# EAGLE design CAN_Shield_Board5 (EAGLE 6.6.0)
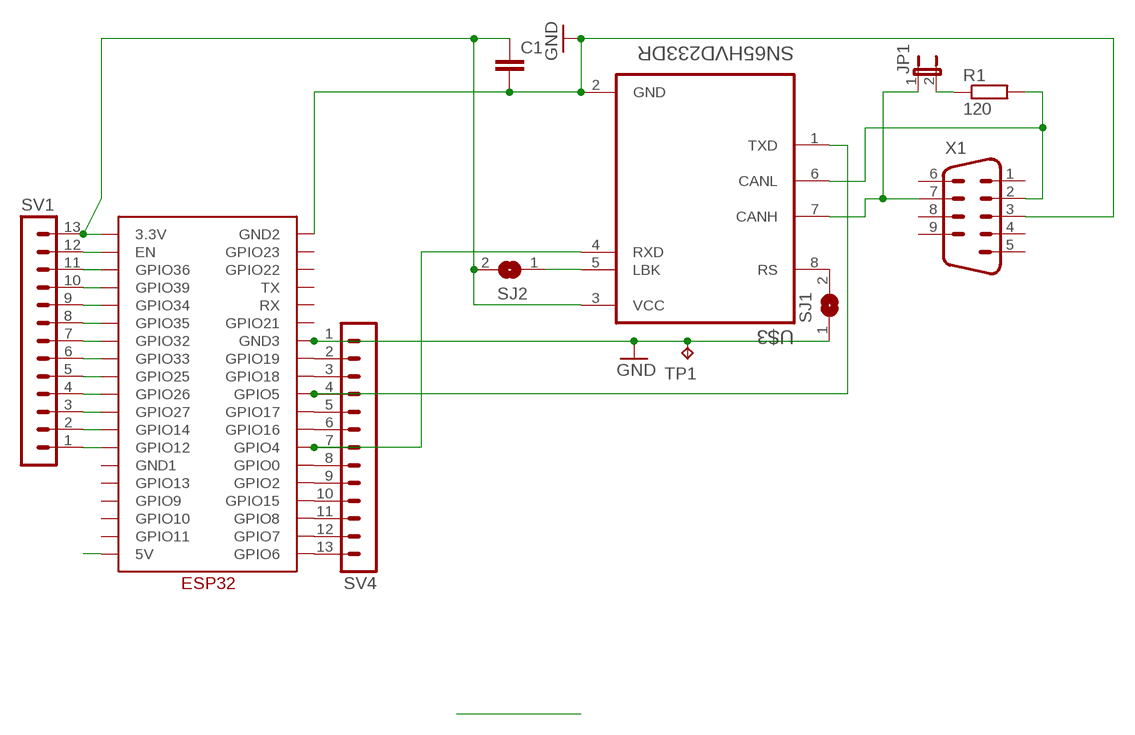
[diagram p0: schematic, sheet 1]

## Parts
C1  C-EUC0805  [C0805]
JP1  JP1E  [JP1]
R1  120  R-EU_R0805  [R0805]
SJ1  SJ  [SJ]
SJ2  SJ  [SJ]
SV1  MA13-1  [MA13-1]
SV4  MA13-1  [MA13-1]
TP1  TPPAD1-13Y  [P1-13Y]
U$1  ESP32  [ESP32]
U$3  SN65HVD233DR  [SOIC127P599X175-8N]
X1  M09HP  [M09HP]

## Nets
CANHI: JP1.1 U$3.7(CANH) X1.7
CANLO: R1.2 U$3.6(CANL) X1.2
CANRX: SV4.7 U$1.GPIO4 U$3.4(RXD)
CANTX: SV4.4 U$1.GPIO5 U$3.1(TXD)
GND: C1.2 SJ1.1 SV4.1 TP1.TP U$1.GND2 U$1.GND3 U$3.2(GND) X1.3
N$1: SV1.1 U$1.GPIO12
N$2: SV1.2 U$1.GPIO14
N$3: SV1.3 U$1.GPIO27
N$4: SV1.4 U$1.GPIO26
N$5: SV1.5 U$1.GPIO25
N$6: SJ1.2 U$3.8(RS)
N$7: SV1.6 U$1.GPIO33
N$8: SV1.7 U$1.GPIO32
N$9: SV1.8 U$1.GPIO35
N$10: SV1.9 U$1.GPIO34
N$11: SV1.10 U$1.GPIO39
N$12: SV1.11 U$1.GPIO36
N$13: SJ2.1 U$3.5(LBK)
N$15: SV1.12 U$1.EN
N$18: SV4.2 U$1.GPIO19
N$19: SV4.3 U$1.GPIO18
N$20: SV4.5 U$1.GPIO17
N$21: SV4.6 U$1.GPIO16
N$22: SV4.8 U$1.GPIO0
N$25: SV4.9 U$1.GPIO2
N$27: SV4.10 U$1.GPIO15
N$31: JP1.2 R1.1
N$33: SV4.11 U$1.GPIO8
N$34: SV4.12 U$1.GPIO7
N$35: U$1.5V
N$36: SV4.13 U$1.GPIO6
VCC: C1.1 SJ2.2 SV1.13 U$1.3.3V U$3.3(VCC)
Unconnected: U$1.GND1 U$1.GPIO9 U$1.GPIO10 U$1.GPIO11 U$1.GPIO13 U$1.GPIO21 U$1.GPIO22 U$1.GPIO23 U$1.RX U$1.TX X1.1 X1.4 X1.5 X1.6 X1.8 X1.9

## Library data of the parts
C1 = rcl:C-EU: CAPACITOR, European symbol
JP1 = jumper:JP1E: JUMPER
R1 = rcl:R-EU_: RESISTOR, European symbol
SJ1 SJ2 = jumper:SJ: SMD solder JUMPER
SV1 SV4 = con-lstb:MA13-1: PIN HEADER; OC_FARNELL: unknown; OC_NEWARK: unknown
TP1 = testpad:TP: Test pad
U$1 = ESP32:ESP32
U$3 = SN65HVD233DR:SN65HVD233DR: Check availability <https://pricing.snapeda.com/parts/SN65HVD233DR/Texas%20Instruments/view-part?ref=eda>; AVAILABILITY: In Stock; DESCRIPTION: 3.3 V CAN Transceiver with Standby Mode, Loopback; MF: Texas Instruments; MP: SN65HVD233DR; PACKAGE: SOIC-8 Texas Instruments; PRICE: None; PURCHASE-URL: https://pricing.snapeda.com/search/part/SN65HVD233DR/?ref=eda
X1 = con-subd:M09: SUB-D; OC_FARNELL: unknown; OC_NEWARK: unknown

## Board
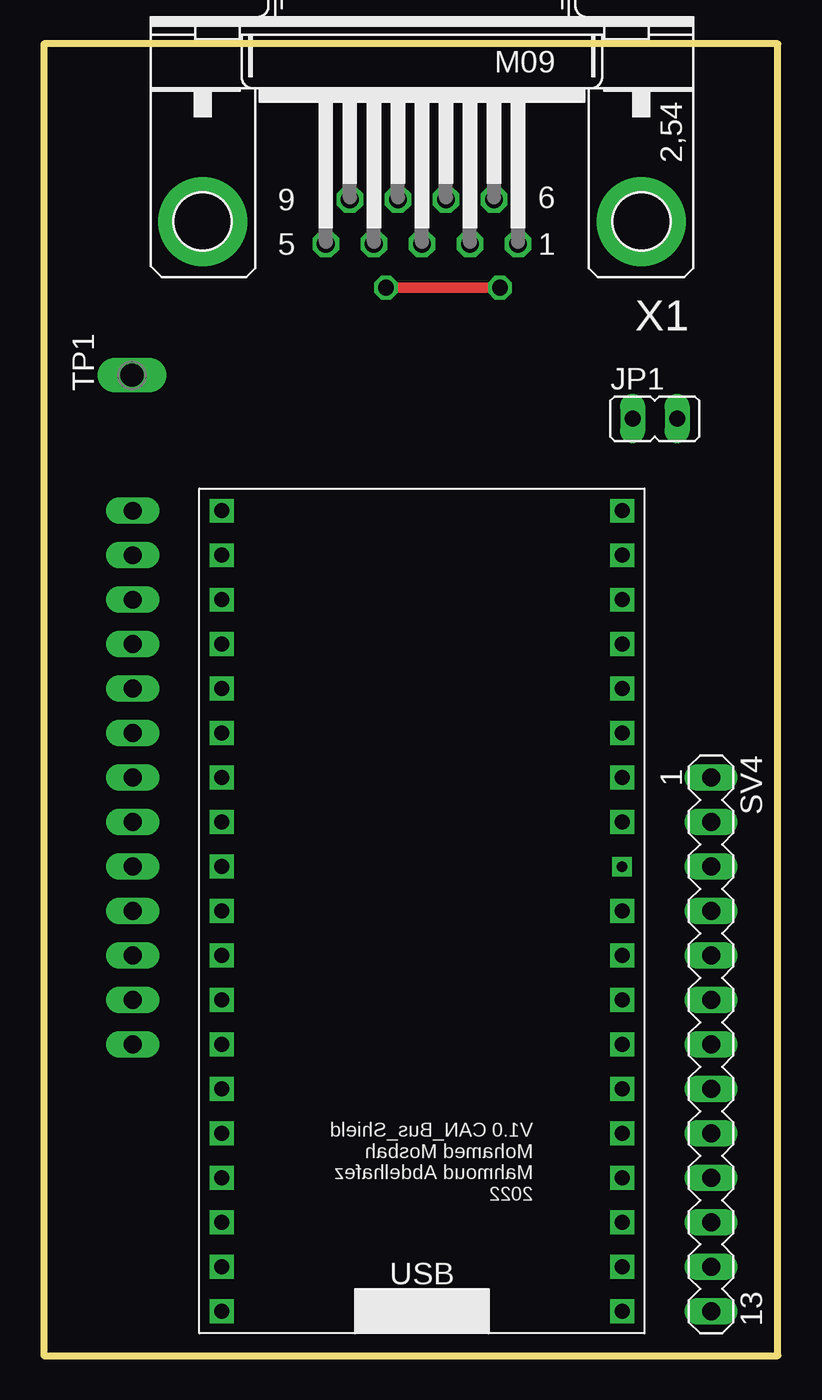
[diagram p1: board, top side]
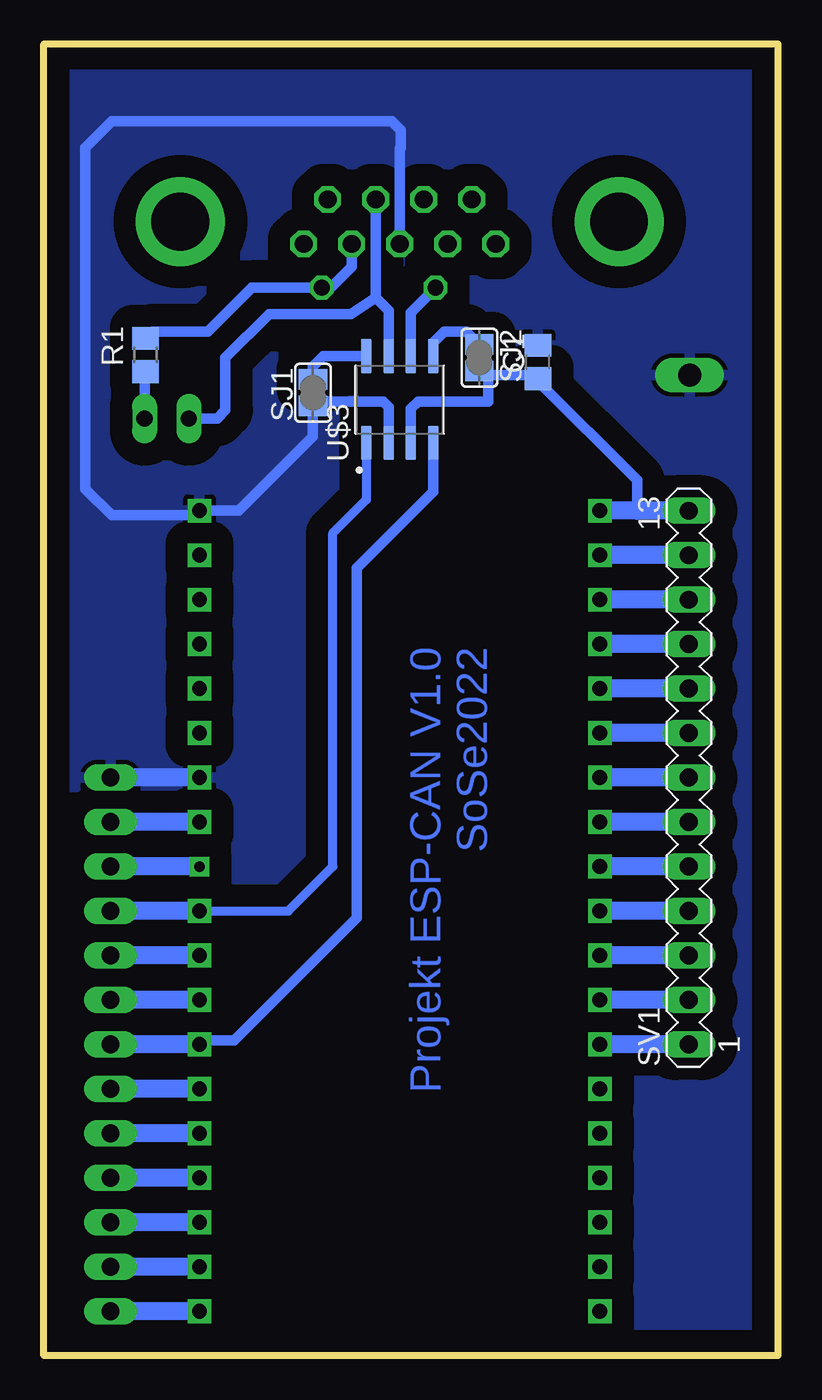
[diagram p2: board, bottom side, seen from below]

Size 41.91 x 74.93 mm. Coordinates in mm from the lower left corner, seen from the top.
Outline: 0,0 41.91,0 41.91,74.93 0,74.93 0,0
Copper layers (1*16): Top 0.035mm / dielectric 1.5mm / Bottom 0.035mm
Design rules "default": minimum track width 6mil, minimum drill 0.35mm, track to track 6mil, track to pad 6mil, pad to pad 6mil, via to via 6mil, smd to smd 6mil, copper to edge 40mil, drill to drill 6mil, minimum pad ring 10mil, minimum via ring 8mil, stop-mask expansion 4mil, vias tented up to drill 0mil, thermal gap 10mil

### Footprints (pad centres in the part's own frame; a part is rotated, then mirrored left to right if it is on the bottom)
C0805 = smd 1.3 x 1.5: 1 -0.95,0; 2 0.95,0
JP1 = drill 0.914 long: 1 0,-1.27; 2 0,1.27
R0805 = smd 1.3 x 1.5: 1 -0.95,0; 2 0.95,0
SJ = smd 1.168 x 1.6: 1 -0.762,0; 2 0.762,0
MA13-1 = drill 1.016 long: 1 -15.24,0; 2 -12.7,0; 3 -10.16,0; 4 -7.62,0; 5 -5.08,0; 6 -2.54,0; 7 0,0; 8 2.54,0; 9 5.08,0; 10 7.62,0; 11 10.16,0; 12 12.7,0; 13 15.24,0
P1-13Y = drill 1.321 pad 1.905 long: TP 0,0
ESP32 = drill 0.85 square: 3.3V 1.27,46.99; 5V 1.27,1.27; EN 1.27,44.45; GND1 1.27,13.97; GND2 24.13,46.99; GND3 24.13,31.75; GPIO0 24.13,13.97; GPIO2 24.13,11.43; GPIO4 24.13,16.51; GPIO5 24.13,24.13; GPIO6 24.13,1.27; GPIO7 24.13,3.81; GPIO8 24.13,6.35; GPIO9 1.27,8.89; GPIO10 1.27,6.35; GPIO11 1.27,3.81; GPIO12 1.27,16.51; GPIO13 1.27,11.43; GPIO14 1.27,19.05; GPIO15 24.13,8.89; GPIO16 24.13,19.05; GPIO17 24.13,21.59; GPIO19 24.13,29.21; GPIO21 24.13,34.29; GPIO22 24.13,41.91; GPIO23 24.13,44.45; GPIO25 1.27,26.67; GPIO26 1.27,24.13; GPIO27 1.27,21.59; GPIO32 1.27,31.75; GPIO33 1.27,29.21; GPIO34 1.27,36.83; GPIO35 1.27,34.29; GPIO36 1.27,41.91; GPIO39 1.27,39.37; RX 24.13,36.83; TX 24.13,39.37 | drill 0.6 square: GPIO18 24.13,26.67
SOIC127P599X175-8N = smd 1.97 x 0.6: 1 -2.47,1.905; 2 -2.47,0.635; 3 -2.47,-0.635; 4 -2.47,-1.905; 5 2.47,-1.905; 6 2.47,-0.635; 7 2.47,0.635; 8 2.47,1.905
M09HP = drill 1.016 octagon: 1 -5.486,1.27; 2 -2.743,1.27; 3 0,1.27; 4 2.743,1.27; 5 5.486,1.27; 6 -4.115,-1.27; 7 -1.372,-1.27; 8 1.372,-1.27; 9 4.115,-1.27 | drill 3.302 pad 5.08: G1 -12.522,0; G2 12.522,0

### Placement (x,y rotation side)
C1  13.7,56.75 90 bottom
JP1  34.89,53.52 270 top
R1  36.1,57.16 90 bottom
SJ1  26.54,55 90 bottom
SJ2  17.04,57 270 bottom
SV1  5.08,33.02 90 bottom
SV4  38.1,17.78 270 top
TP1  5.04,56 90 top
U$1  8.89,1.27 0 top
U$2  [PASSMARK]  90.04,78 0 top  (outside the outline)
U$3  21.59,54.61 90 bottom
U$4  [PASSMARK]  -38.96,81 0 top  (outside the outline)
U$5  [PASSMARK]  -41.46,-15.5 0 top  (outside the outline)
U$6  [PASSMARK]  81.54,-11 0 top  (outside the outline)
X1  21.59,64.77 180 top

### Tracks (layer width: path | path; a pad name or v marks a point on that pad's centre or on a via)
CANHI
  Bottom 0.61: U$3.7 22.22,59.69 22.96,60.42 | X1.7 22.96,60.42 | JP1.1 32.02,53.52 31.54,54 31.54,57 29.04,59.5 24.38,59.5 22.96,60.42
CANLO  (via drill 0.9)
  Top 0.61: v19.54,61 v26.04,61
  Bottom 0.61: U$3.6 20.95,59.59 v19.54,61 | R1.2 35.71,58.5 32.54,58.5 30.04,61 v26.04,61 25.54,61 24.33,62.21 X1.2
CANRX
  Bottom 0.61: U$3.4 19.68,49.35 24.04,45 24.04,25 31.04,18 32.8,18 U$1.GPIO4
  Bottom 1.016: U$1.GPIO4 SV4.7
CANTX
  Bottom 0.508: U$1.GPIO5 27.94,25.4 25.4,27.94 25.4,46.99 23.49,48.9 U$3.1
  Bottom 1.016: U$1.GPIO5 SV4.4
GND
  Bottom 0.61: X1.3 21.59,68.95 21.54,69 21.54,70 22.04,70.5 38.04,70.5 39.54,69 39.54,49.5 38.04,48 33.28,48 U$1.GND2 30.78,48.26 26.54,52.5 SJ1.1 26.28,54.5 22.54,54.5 22.22,54.19 U$3.2
  Bottom 1.016: U$1.GND3 SV4.1
  pour Bottom (isolate 1.27): -7.96,93.5 56.54,93.5 56.54,-17 -8.46,-17 -8.46,93.5
N$1
  Bottom 1.016: SV1.1 U$1.GPIO12
N$2
  Bottom 1.016: SV1.2 U$1.GPIO14
N$3
  Bottom 1.016: SV1.3 U$1.GPIO27
N$4
  Bottom 1.016: SV1.4 U$1.GPIO26
N$5
  Bottom 1.016: SV1.5 U$1.GPIO25
N$6
  Bottom 0.61: U$3.8 25.96,57.08 26.54,56.5 SJ1.2
N$7
  Bottom 1.016: SV1.6 U$1.GPIO33
N$8
  Bottom 1.016: SV1.7 U$1.GPIO32
N$9
  Bottom 1.016: SV1.8 U$1.GPIO35
N$10
  Bottom 1.016: SV1.9 U$1.GPIO34
N$11
  Bottom 1.016: SV1.10 U$1.GPIO39
N$12
  Bottom 1.016: SV1.11 U$1.GPIO36
N$13
  Bottom 0.61: U$3.5 19.68,57.85 19.04,58.5 17.78,58.5 SJ2.1
N$15
  Bottom 1.016: SV1.12 U$1.EN
N$18
  Bottom 1.016: U$1.GPIO19 SV4.2
N$19
  Bottom 1.016: U$1.GPIO18 SV4.3
N$20
  Bottom 1.016: U$1.GPIO17 SV4.5
N$21
  Bottom 1.016: U$1.GPIO16 SV4.6
N$22
  Bottom 1.016: U$1.GPIO0 SV4.8
N$25
  Bottom 1.016: U$1.GPIO2 SV4.9
N$27
  Bottom 1.016: U$1.GPIO15 SV4.10
N$31
  Bottom 0.61: JP1.2 36.16,56.12 36.54,56.5 36.39,56.5 R1.1
N$33
  Bottom 1.016: U$1.GPIO8 SV4.11
N$34
  Bottom 1.016: U$1.GPIO7 SV4.12
N$36
  Bottom 1.016: U$1.GPIO6 SV4.13
VCC
  Bottom 0.406: U$3.3 20.95,51.44
  Bottom 0.61: U$3.3 20.95,54.09 20.54,54.5 16.54,54.5 16.54,56 | 16.54,56 13.9,56 C1.1 13.7,55.66 8.04,50 8.04,48.26 | SJ2.2 16.78,56.24 16.54,56
  Bottom 1.016: SV1.13 8.04,48.26 U$1.3.3V

### Text on the board
Bottom: Bottom | Projekt ESP-CAN V1.0 / SoSe2022
tNames: V1.0 CAN_Bus_Shield / Mohamed Mosbah / Mahmoud Abdelhafez / 2022